# EAGLE design Programmer (EAGLE 9.6.2)
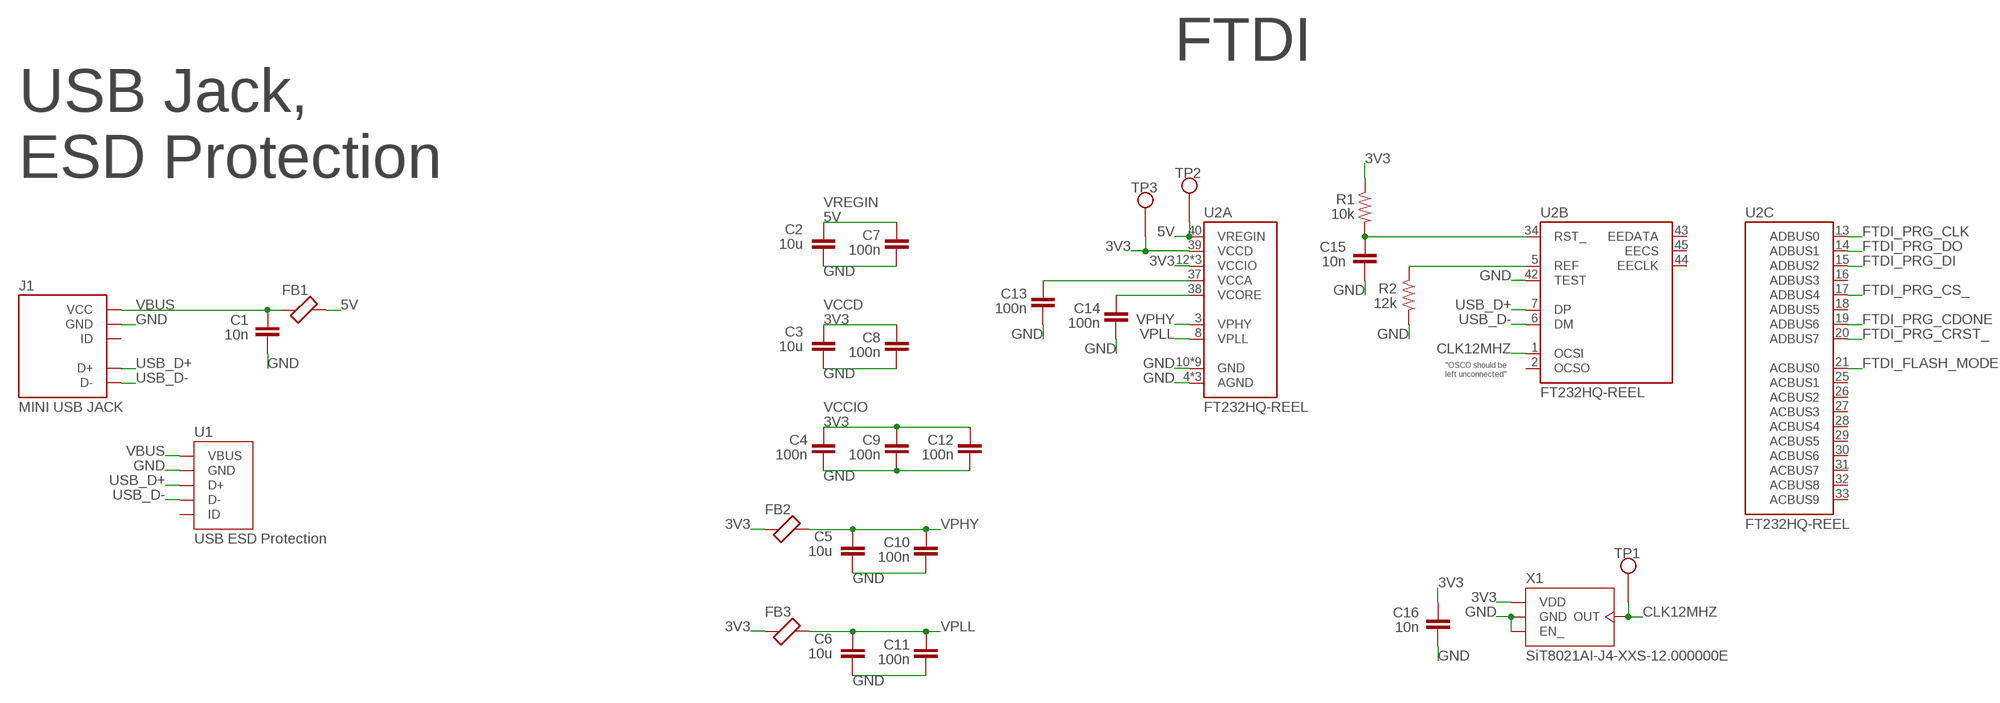
[diagram p0: schematic, sheet 1, part 1 of 2]
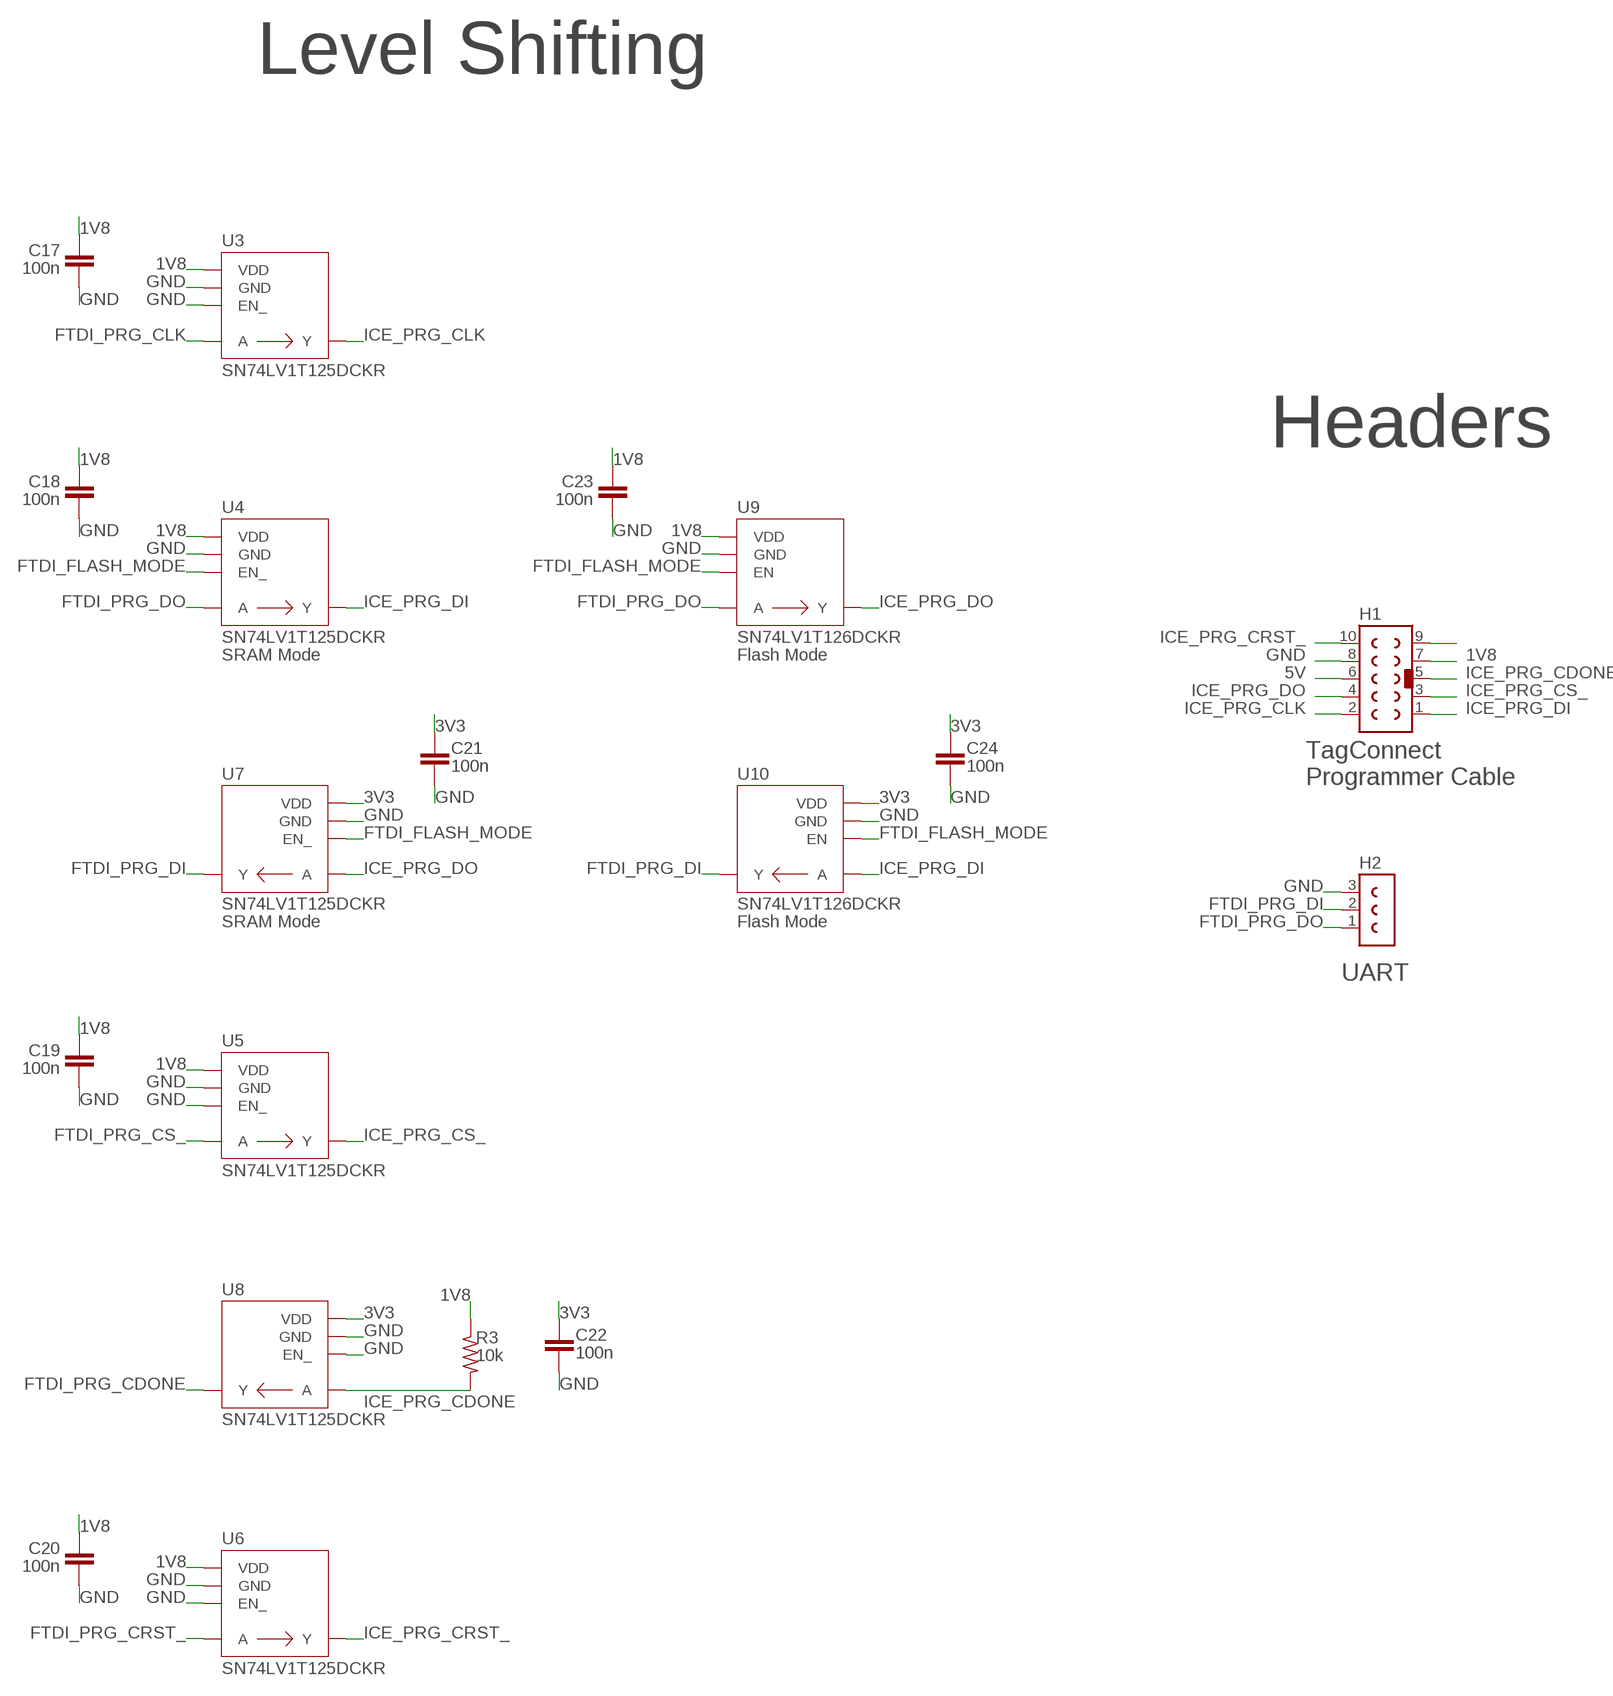
[diagram p1: schematic, sheet 1, part 2 of 2]

## Parts
C1  10n  CAPACITOR0402  [0402]
C2  10u  CAPACITOR1206  [1206]
C3  10u  CAPACITOR1206  [1206]
C4  100n  CAPACITOR0402  [0402]
C5  10u  CAPACITOR1206  [1206]
C6  10u  CAPACITOR1206  [1206]
C7  100n  CAPACITOR0402  [0402]
C8  100n  CAPACITOR0402  [0402]
C9  100n  CAPACITOR0402  [0402]
C10  100n  CAPACITOR0402  [0402]
C11  100n  CAPACITOR0402  [0402]
C12  100n  CAPACITOR0402  [0402]
C13  100n  CAPACITOR0402  [0402]
C14  100n  CAPACITOR0402  [0402]
C15  10n  CAPACITOR0402  [0402]
C16  10n  CAPACITOR0402  [0402]
C17  100n  CAPACITOR0402  [0402]
C18  100n  CAPACITOR0402  [0402]
C19  100n  CAPACITOR0402  [0402]
C20  100n  CAPACITOR0402  [0402]
C21  100n  CAPACITOR0402  [0402]
C22  100n  CAPACITOR0402  [0402]
C23  100n  CAPACITOR0402  [0402]
C24  100n  CAPACITOR0402  [0402]
FB1  FERRITE-BEAD1206  [1206]
FB2  FERRITE-BEAD1206  [1206]
FB3  FERRITE-BEAD1206  [1206]
H1  WURTH-61201021621  [WURTH-61201021621]
H2  HEADER-1X3  [HEADER-1X3]
J1  MINI-USB-JACK  [AMPHENOLFCI-10033526-N3222MLF]
R1  10k  RESISTOR0402  [0402]
R2  12k  RESISTOR0402  [0402]
R3  10k  RESISTOR0402  [0402]
TP1  TEST-POINT  [TEST-POINT]
TP2  TEST-POINT  [TEST-POINT]
TP3  TEST-POINT  [TEST-POINT]
U1  TPD4S012DRYR  [TPD4S012DRYR]
U2  FT232HQ  [FT232HQ]
U3  SN74LV1T125DCKR  [SN74LV1T12XDCKR]
U4  SN74LV1T125DCKR  [SN74LV1T12XDCKR]
U5  SN74LV1T125DCKR  [SN74LV1T12XDCKR]
U6  SN74LV1T125DCKR  [SN74LV1T12XDCKR]
U7  SN74LV1T125DCKR  [SN74LV1T12XDCKR]
U8  SN74LV1T125DCKR  [SN74LV1T12XDCKR]
U9  SN74LV1T126DCKR  [SN74LV1T12XDCKR]
U10  SN74LV1T126DCKR  [SN74LV1T12XDCKR]
X1  SITIME-SIT8021  [SITIME-SIT8021]

## Nets
1V8: C17.1 C18.1 C19.1 C20.1 C23.1 H1.7 R3.1 U3.5(VDD) U4.5(VDD) U5.5(VDD) U6.5(VDD) U9.5(VDD)
3V3: C3.1 C4.1 C8.1 C9.1 C12.1 C16.1 C21.1 C22.1 C24.1 FB2.1 FB3.1 R1.1 TP3.X U2.12(A:VCCIO) U2.24(A:VCCIO) U2.39(A:VCCD) U2.46(A:VCCIO) U7.5(VDD) U8.5(VDD) U10.5(VDD) X1.3(VDD)
5V: C2.1 C7.1 FB1.2 H1.6 TP2.X U2.40(A:VREGIN)
CLK12MHZ: TP1.X U2.1(B:OCSI) X1.2(OUT)
FTDI_FLASH_MODE: U2.21(C:ACBUS0) U4.1(EN_) U7.1(EN_) U9.1(EN) U10.1(EN)
FTDI_PRG_CDONE: U2.19(C:ADBUS6) U8.4(Y)
FTDI_PRG_CLK: U2.13(C:ADBUS0) U3.2(A)
FTDI_PRG_CRST_: U2.20(C:ADBUS7) U6.2(A)
FTDI_PRG_CS_: U2.17(C:ADBUS4) U5.2(A)
FTDI_PRG_DI: H2.2 U2.15(C:ADBUS2) U7.4(Y) U10.4(Y)
FTDI_PRG_DO: H2.1 U2.14(C:ADBUS1) U4.2(A) U9.2(A)
GND: C1.2 C2.2 C3.2 C4.2 C5.2 C6.2 C7.2 C8.2 C9.2 C10.2 C11.2 C12.2 C13.2 C14.2 C15.2 C16.2 C17.2 C18.2 C19.2 C20.2 C21.2 C22.2 C23.2 C24.2 H1.8 H2.3 J1.GND J1.GND2(GND) J1.GND3(GND) J1.GND4(GND) J1.GND5(GND) R2.2 U1.4(GND) U2.4(A:AGND) U2.9(A:AGND) U2.10(A:GND) U2.11(A:GND) U2.22(A:GND) U2.23(A:GND) U2.35(A:GND) U2.36(A:GND) U2.41(A:AGND) U2.42(B:TEST) U2.47(A:GND) U2.48(A:GND) U2.49(A:GND) U3.1(EN_) U3.3(GND) U4.3(GND) U5.1(EN_) U5.3(GND) U6.1(EN_) U6.3(GND) U7.3(GND) U8.1(EN_) U8.3(GND) U9.3(GND) U10.3(GND) X1.1(EN_) X1.4(GND)
ICE_PRG_CDONE: H1.5 R3.2 U8.2(A)
ICE_PRG_CLK: H1.2 U3.4(Y)
ICE_PRG_CRST_: H1.10 U6.4(Y)
ICE_PRG_CS_: H1.3 U5.4(Y)
ICE_PRG_DI: H1.1 U4.4(Y) U10.2(A)
ICE_PRG_DO: H1.4 U7.2(A) U9.4(Y)
N$1: C15.1 R1.2 U2.34(B:RST_)
N$3: C13.1 U2.37(A:VCCA)
N$4: R2.1 U2.5(B:REF)
N$5: C14.1 U2.38(A:VCORE)
N$13: H1.9
USB_D+: J1.D+ U1.1(D+) U2.7(B:DP)
USB_D-: J1.D- U1.2(D-) U2.6(B:DM)
VBUS: C1.1 FB1.1 J1.VCC U1.6(VBUS)
VPHY: C5.1 C10.1 FB2.2 U2.3(A:VPHY)
VPLL: C6.1 C11.1 FB3.2 U2.8(A:VPLL)
Unconnected: J1.ID U1.3(ID) U2.2(B:OCSO) U2.16(C:ADBUS3) U2.18(C:ADBUS5) U2.25(C:ACBUS1) U2.26(C:ACBUS2) U2.27(C:ACBUS3) U2.28(C:ACBUS4) U2.29(C:ACBUS5) U2.30(C:ACBUS6) U2.31(C:ACBUS7) U2.32(C:ACBUS8) U2.33(C:ACBUS9) U2.43(B:EEDATA) U2.44(B:EECLK) U2.45(B:EECS)

## Notes on the sheet
- Level Shifting
- FTDI
- USB Jack,
  ESD Protection
- VREGIN
- Headers
- VCCD
- "OSCO should be
  left unconnected"
- SRAM Mode | Flash Mode
- VCCIO
- TagConnect
  Programmer Cable
- SRAM Mode | Flash Mode
- UART

## Library data of the parts
C1 C15 C16 = EagleLibrary:CAPACITOR; MFG: Murata; PN: GCM155R71H103JA55D
C2 C3 C5 C6 = EagleLibrary:CAPACITOR; MFG: Murata; PN: GCM31CC71E106KA03K
C4 C7-C14 C17-C24 = EagleLibrary:CAPACITOR; MFG: Murata; PN: GRM155R61H104KE19D
FB1-FB3 = EagleLibrary:FERRITE-BEAD; MFG: Murata; PN: BLM31KN801SN1L
H1 = EagleLibrary:WURTH-61201021621; MFG: Wurth Elektronik; PN: 61201021621
H2 = EagleLibrary:HEADER-1X3; MFG: Molex; PN: 22-28-4100
J1 = EagleLibrary:MINI-USB-JACK: Mini USB Jack; MFG: Amphenol FCI; PN: 10033526-N3222MLF
R1 R3 = EagleLibrary:RESISTOR; MFG: Vishay; PN: CRCW040210K0FKEDC
R2 = EagleLibrary:RESISTOR; MFG: Vishay; PN: CRCW040212K0FKEDC
TP1-TP3 = EagleLibrary:TEST-POINT: Bare copper test point
U1 = EagleLibrary:TPD4S012DRYR: 4x USB ESD diode; MFG: Texas Instruments; PN: TPD4S012DRYR
U2 = EagleLibrary:FT232HQ: FTDI chip: USB to UART/FIFO; MFG: FTDI; PN: FT232HQ-REEL
U3-U8 = EagleLibrary:SN74LV1T125DCKR: 1x Level Shifter; MFG: Texas Instruments; PN: SN74LV1T125DCKR
U9 U10 = EagleLibrary:SN74LV1T126DCKR: 1x Level Shifter; MFG: Texas Instruments; PN: SN74LV1T126DCKR
X1 = EagleLibrary:SITIME-SIT8021: MEMS Oscillator; MFG: SiTime; PN: SiT8021AI-J4-XXS-12.000000E

## Board
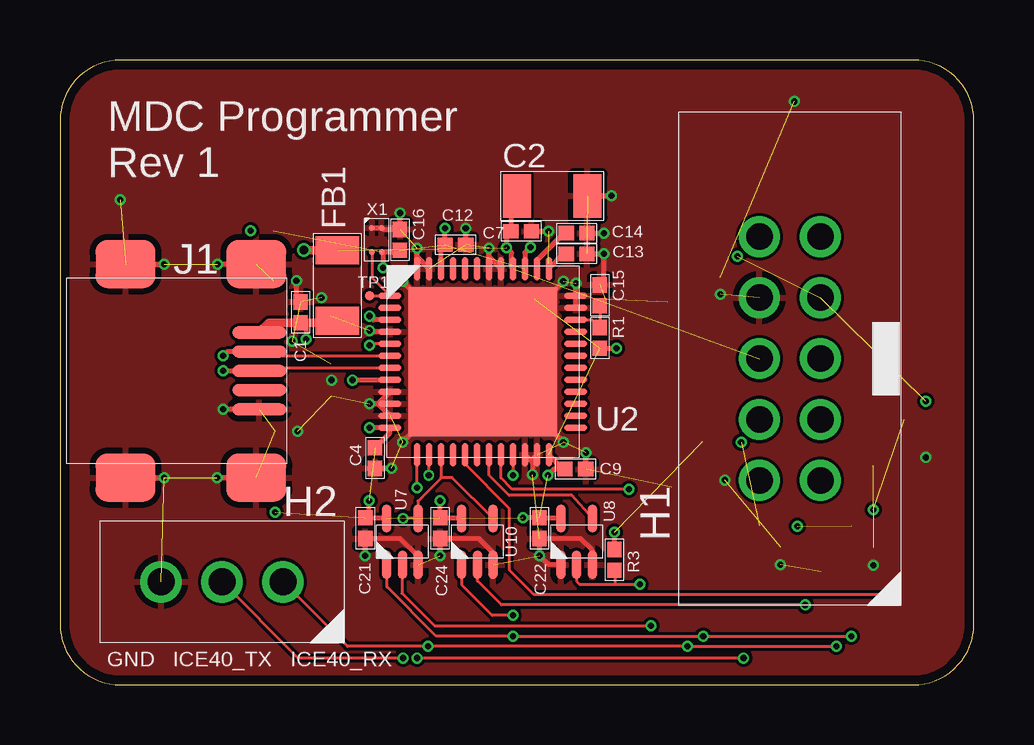
[diagram p2: board, top side]
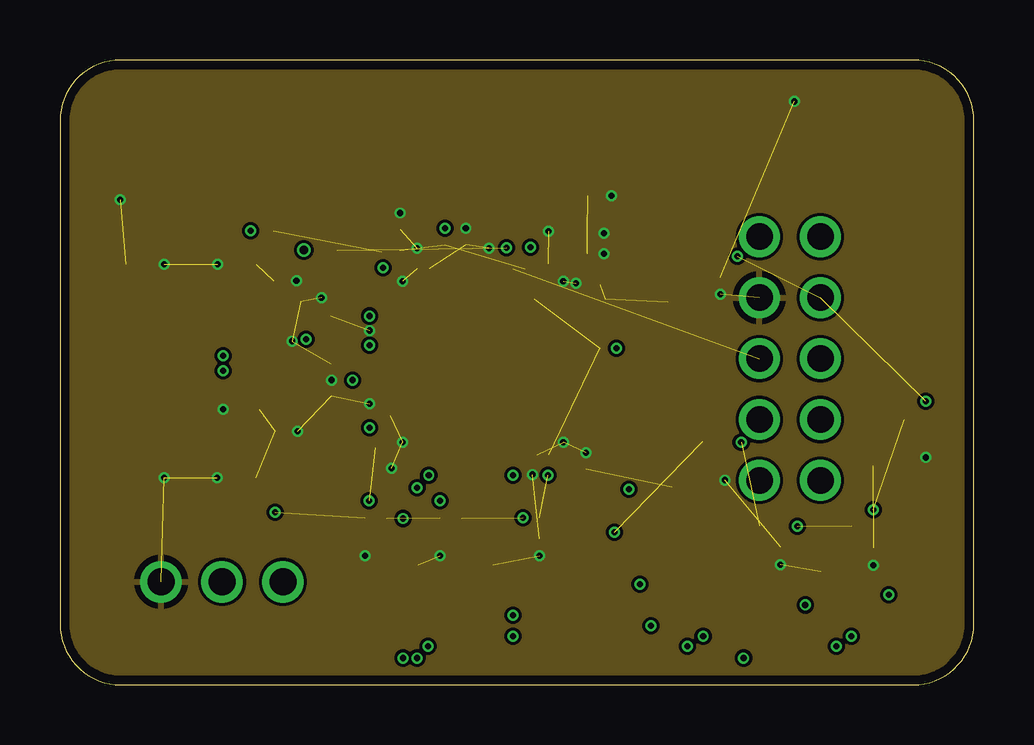
[diagram p3: board, inner layer Ground]
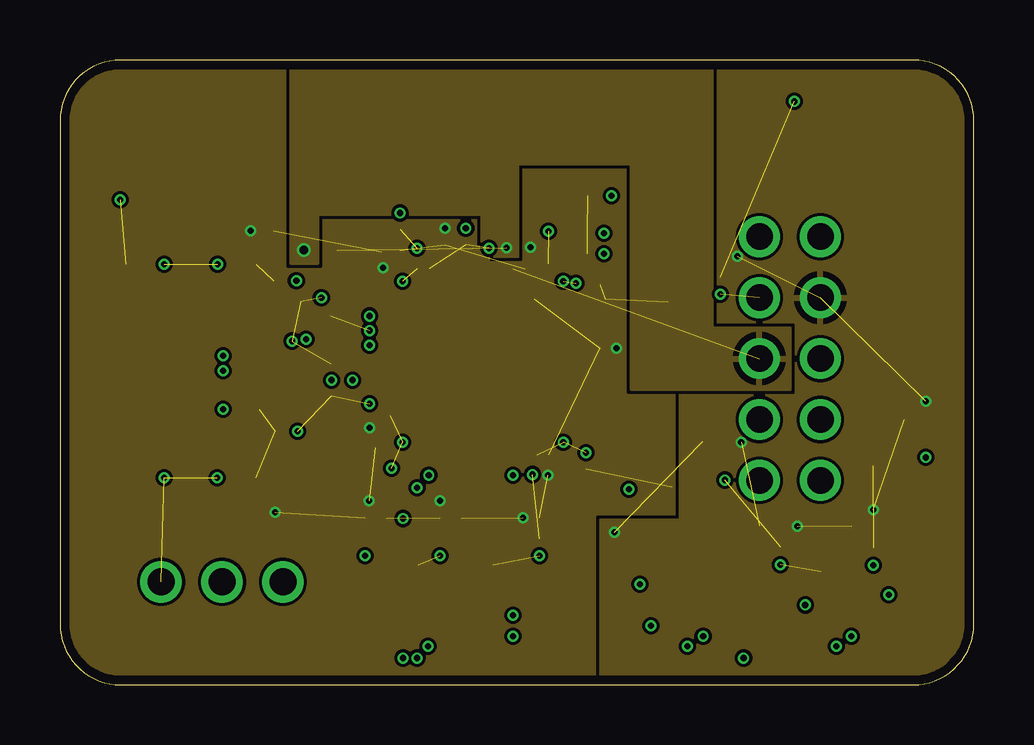
[diagram p4: board, inner layer Power]
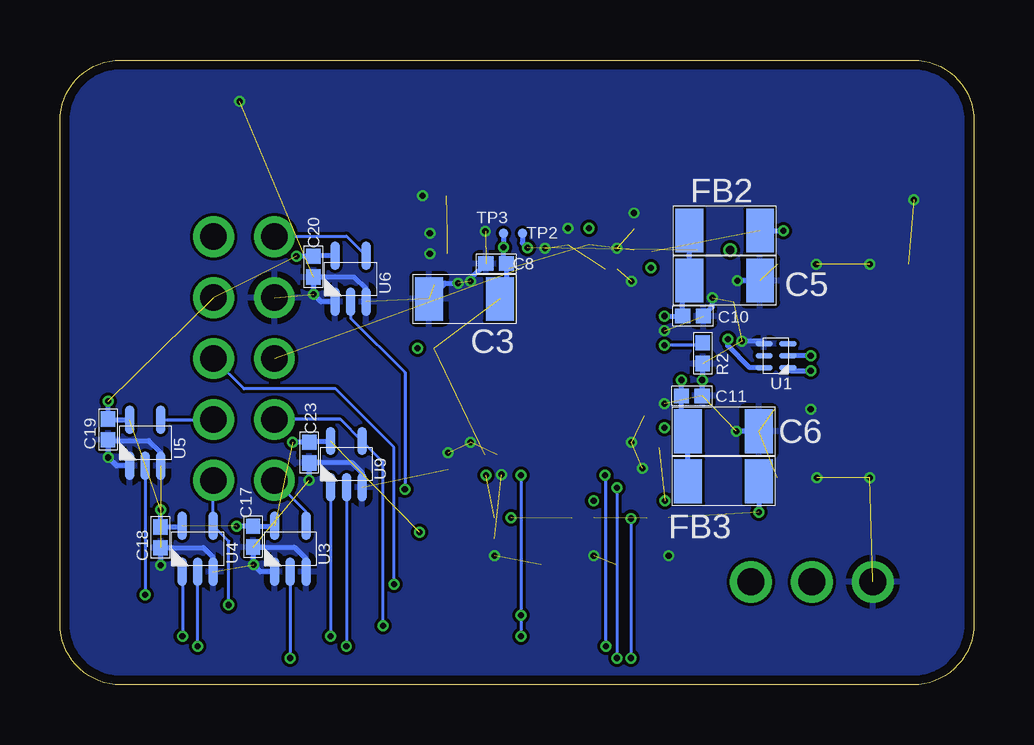
[diagram p5: board, bottom side, seen from below]

Size 38.1 x 26.04 mm. Coordinates in mm from the lower left corner, seen from the top.
Outline: 0,23.5 0,2.54 arc90 2.54,0 35.56,0 arc90 38.1,2.54 38.1,23.5 arc90 35.56,26.04 2.54,26.04 arc90 0,23.5
Copper layers (1*2*15*16): Top 0.035559375mm / dielectric 0.17018125mm / Ground 0.01778125mm / dielectric 47mil / Power 0.01778125mm / dielectric 0.17018125mm / Bottom 0.035559375mm
Design rules "OshPark4Layer-TentVias": minimum track width 5mil, minimum drill 10mil, track to track 5mil, track to pad 5mil, pad to pad 5mil, via to via 5mil, smd to smd 5mil, copper to edge 15mil, drill to drill 6mil, minimum pad ring 4mil, minimum via ring 4mil, stop-mask expansion 2.5mil, vias tented up to drill 25mil, thermal gap 10mil

### Footprints (pad centres in the part's own frame; a part is rotated, then mirrored left to right if it is on the bottom)
0402 = smd 0.635 x 0.6: 1 -0.432,0; 2 0.432,0
1206 = smd 1.165 x 1.815: 1 -1.475,0; 2 1.475,0
WURTH-61201021621 = drill 1.105 pad 1.705: 1 5.895,-15.36; 2 3.355,-15.36; 3 5.895,-12.82; 4 3.355,-12.82; 5 5.895,-10.28; 6 3.355,-10.28; 7 5.895,-7.74; 8 3.355,-7.74; 9 5.895,-5.2; 10 3.355,-5.2
HEADER-1X3 = drill 1.133 pad 1.733: 1 2.54,2.54; 2 2.54,5.08; 3 2.54,7.62
AMPHENOLFCI-10033526-N3222MLF = smd 0.5 x 2.25: D+ 0,2.85; D- -0.8,2.85; GND 1.6,2.85; ID 0.8,2.85; VCC -1.6,2.85 | smd 2 x 2.5: GND2 -4.45,2.725; GND3 -4.45,-2.725; GND4 4.45,-2.725; GND5 4.45,2.725
TEST-POINT = smd 0.4 x 0.4: X 0,0
TPD4S012DRYR = smd 0.71 x 0.22: 1 -0.495,0.5; 2 -0.495,0; 3 -0.495,-0.5; 4 0.495,-0.5; 5 0.495,0; 6 0.495,0.5
FT232HQ = smd 0.961 x 0.27: 1 -3.876,2.75; 2 -3.876,2.25; 3 -3.876,1.75; 4 -3.876,1.25; 5 -3.876,0.75; 6 -3.876,0.25; 7 -3.876,-0.25; 8 -3.876,-0.75; 9 -3.876,-1.25; 10 -3.876,-1.75; 11 -3.876,-2.25; 12 -3.876,-2.75; 25 3.876,-2.75; 26 3.876,-2.25; 27 3.876,-1.75; 28 3.876,-1.25; 29 3.876,-0.75; 30 3.876,-0.25; 31 3.876,0.25; 32 3.876,0.75; 33 3.876,1.25; 34 3.876,1.75; 35 3.876,2.25; 36 3.876,2.75 | smd 0.27 x 0.961: 13 -2.75,-3.876; 14 -2.25,-3.876; 15 -1.75,-3.876; 16 -1.25,-3.876; 17 -0.75,-3.876; 18 -0.25,-3.876; 19 0.25,-3.876; 20 0.75,-3.876; 21 1.25,-3.876; 22 1.75,-3.876; 23 2.25,-3.876; 24 2.75,-3.876; 37 2.75,3.876; 38 2.25,3.876; 39 1.75,3.876; 40 1.25,3.876; 41 0.75,3.876; 42 0.25,3.876; 43 -0.25,3.876; 44 -0.75,3.876; 45 -1.25,3.876; 46 -1.75,3.876; 47 -2.25,3.876; 48 -2.75,3.876 | smd 6.2 x 6.2: 49 0,0
SN74LV1T12XDCKR = smd 1.186 x 0.397: 1 -0.962,0.65; 2 -0.962,0; 3 -0.962,-0.65; 4 0.962,-0.65; 5 0.962,0.65
SITIME-SIT8021 = smd 0.25 x 0.25: 1 -0.205,0.5; 2 -0.205,-0.5; 3 0.205,-0.5; 4 0.205,0.5

### Placement (x,y rotation side)
C1  10.03,15.52 90 top
C2  20.52,20.37 0 top
C3  21.23,16.08 180 bottom
C4  13.13,9.45 270 top
C5  10.39,16.84 0 bottom
C6  10.44,10.57 0 bottom
C7  19.23,18.9 0 top
C8  19.91,17.55 180 bottom
C9  21.49,8.99 0 top
C10  11.71,15.37 0 bottom
C11  11.76,12.04 0 bottom
C12  16.48,18.34 0 top
C13  21.54,17.96 0 top
C14  21.54,18.82 0 top
C15  22.5,16.23 90 top
C16  14.17,18.54 90 top
C17  30.05,6.17 270 bottom
C18  33.91,6.15 270 bottom
C19  36.09,10.64 270 bottom
C20  27.53,17.42 270 bottom
C21  12.73,6.53 270 top
C22  19.99,6.53 270 top
C23  27.71,9.68 270 bottom
C24  15.85,6.53 270 top
FB1  11.56,16.64 90 top
FB2  10.39,18.92 180 bottom
FB3  10.44,8.48 180 bottom
H1  25.81,23.88 0 top
H2  11.84,1.75 90 top
J1  5.46,13.08 270 top
R1  22.5,14.45 90 top
R2  11.3,13.82 270 bottom
R3  23.11,5.21 270 top
TP1  12.9,16.21 0 top
TP2  18.82,18.82 0 bottom
TP3  19.61,18.82 0 bottom
U1  8.26,13.72 180 bottom
U2  17.63,13.46 0 top
U3  28.5,5.67 90 bottom
U4  32.36,5.67 90 bottom
U5  34.54,10.09 90 bottom
U6  25.98,16.92 90 bottom
U7  14.27,5.97 90 top
U8  21.54,5.97 90 top
U9  26.16,9.2 90 bottom
U10  17.4,5.97 90 top
X1  13.21,18.54 0 top

### Tracks (layer width: path | path; a pad name or v marks a point on that pad's centre or on a via)
1V8  (via drill 0.25)  (6 unrouted)
  Top 0.203: R3.1 v23.11,6.35
  Bottom 0.203: v28.25,17.86 C20.1 27.51,17.88 U6.5 | U9.5 27.66,10.16 C23.1 v28.4,10.11 | U3.5 29.18,6.61 C17.1 v30.73,6.61 | U4.5 33.06,6.58 C18.1 v33.91,7.29 | U5.5 36.07,11.05 C19.1 v36.09,11.81
  pour Power (rank 3): 25.85,6.86 22.53,6.86 22.53,-1.4 47.42,-1.4 47.42,30.89 25.85,30.89
3V3  (via drill 0.25)  (10 unrouted)
  Top 0.203: v12.9,10.71 U2.12 13.75,10.5 C4.1 | C16.1 14.11,18.04 X1.3 13.46,17.99 v13.46,17.37 | U2.46 15.88,18.16 C12.1 v16.05,19.02 | U2.24 20.97,8.99 C9.1 20.6,8.99 v20.34,8.74 | R1.1 v23.19,14.02 | U7.5 13.6,6.96 C21.1 12.88,7.11 v12.88,7.67 | U10.5 16.72,6.96 C24.1 v15.85,7.67 | U8.5 20.86,6.96 C22.1 v19.3,6.96 | v19.61,18.24 19.38,18.01 U2.39
  Bottom 0.203: FB2.1 v7.95,18.92 | C8.1 19.61,17.68 | C8.1 19.48,16.36 C3.1 | FB3.1 v8.96,7.19 | TP3.X v19.61,18.24 | v19.61,18.24 | C8.1 19.61,17.68 v19.61,18.24
  pour Power (rank 6): -8.64,46.56 -8.64,-9.6 45.16,-9.6 45.16,46.56
5V  (via drill 0.25, 0.36)  (2 unrouted)
  Top 0.203: U2.40 18.83,17.39 18.83,18 v18.62,18.21 18.62,18.72 C7.1 | C7.1 18.83,18.87 | C2.1 18.8,20.12 C7.1
  Top 0.356: FB1.2 v10.16,18.11
  Bottom 0.203: TP2.X 18.82,18.41 v18.62,18.21
  pour Power: 27.18,14.88 30.43,14.88 30.43,12.29 23.83,12.29 23.83,21.69 19.08,21.69 19.08,17.83 17.6,17.83 17.6,19.58 10.74,19.58 10.74,17.55 9.63,17.55 9.63,30.61 27.18,30.61
CLK12MHZ
  Top 0.127: X1.2 13,16.96 U2.1 TP1.X
FTDI_FLASH_MODE  (via drill 0.25)
  Top 0.127: U2.21 v18.88,8.74 | U10.1 16.76,4.16 18.02,2.9 v18.88,2.9 | U7.1 13.63,5 13.63,4.08 15.68,2.03 v18.88,2.03 v26.81,2.03 v32.99,2.03
  Bottom 0.127: v18.88,8.74 v18.88,2.9 v18.88,2.03 | U4.1 32.99,4.69 v32.99,2.03 | U9.1 v26.81,2.03 | v26.81,2.03
FTDI_PRG_CDONE
  Top 0.127: U8.4 21.35,7.9 18.72,7.9 17.88,8.74 U2.19
FTDI_PRG_CLK  (via drill 0.25)
  Top 0.127: U2.13 14.88,8.21 v14.88,8.2 | v28.5,1.12 v14.88,1.12
  Bottom 0.127: U3.2 v28.5,1.12 | v14.88,8.2 v14.88,1.12
FTDI_PRG_CRST_  (via drill 0.25)
  Top 0.127: v23.72,8.15 18.84,8.15 18.38,8.62 U2.20
  Bottom 0.127: U6.2 25.98,15.27 23.72,13.02 v23.72,8.15
FTDI_PRG_CS_  (via drill 0.25)
  Top 0.127: v34.54,3.76 19.76,3.76 18.73,4.79 18.73,7.35 16.88,9.21 U2.17
  Bottom 0.127: U5.2 v34.54,3.76
FTDI_PRG_DI  (via drill 0.25)
  Top 0.127: 14.93,7.36 U7.4 | 18.05,7.41 U10.4 16.34,8.64 15.88,8.64 | U2.15 15.88,8.64 | 15.88,8.64 15.88,8.61 14.93,7.65 U7.4 | U7.4 v14.3,6.93 | v14.3,1.12 9.93,1.12 H2.2
  Top 0.152: U10.4 18,6.98
  Bottom 0.127: v14.3,6.93 v14.3,1.12
FTDI_PRG_DO  (via drill 0.25)
  Top 0.127: v15.38,8.73 U2.14 | v32.36,1.6 v26.16,1.6 v15.34,1.6 11.99,1.6 H2.1
  Bottom 0.127: U9.2 v26.16,1.6 | v15.38,8.73 15.37,8.72 15.37,1.63 v15.34,1.6 | v32.36,1.6 U4.2
GND  (via drill 0.25)  (36 unrouted)
  Top 0.203: U2.4 12.95,14.71 v12.9,14.76 | U2.49 v14.28,16.82 | U2.49 v20.98,16.82 | U2.49 v20.98,10.11 | U2.49 v14.28,10.11 | U2.48 v14.88,18.19 14.88,17.84 U2.47 | U2.42 v17.88,18.19 17.88,17.84 U2.41 | U2.23 19.7,9.41 v19.7,8.76 19.7,9.26 U2.22 | U2.10 v12.9,11.71 13.25,11.71 | U2.9 13.25,11.71 | U2.11 13.25,11.71 | C1.2 9.86,16.13 v9.86,16.84 | X1.1 X1.4 13.48,18.97 C16.2 v14.17,19.66 | C4.2 v13.82,9.02 | C9.2 v21.92,9.68 | C12.2 v16.92,19.02 | U2.35 U2.36 v21.5,16.74 | C7.2 v20.37,18.9 | C2.2 v22.99,20.37 | C13.2 v22.68,17.96 22.68,16.84 C15.2 | C14.2 v22.68,18.82 | v12.72,5.38 C21.2 14.19,6.09 14.93,5.36 U7.3 | v15.85,5.38 C24.2 17.46,6.09 18.05,5.5 U10.3 | U8.3 22.2,5.6 21.7,6.09 C22.2 v19.99,5.38 20.37,5.01 U8.1 | J1.GND3 v4.34,17.53 | J1.GND2 v6.58,17.53 | J1.GND4 v4.34,8.63 | J1.GND5 v6.55,8.63 | J1.GND v6.81,11.48
  Bottom 0.203: U1.4 8.86,14.33 v9.68,14.33 | C6.2 v9.91,10.57 | C11.2 v11.33,12.7 11.33,13.36 R2.2 | C10.2 10.9,15.75 v10.9,16.13 | C5.2 v9.86,16.84 | C3.2 22.05,16.74 v21.5,16.74 | U6.1 27.21,15.95 v27.53,16.28 C20.2 25.85,16.99 25.33,16.48 U6.3 | v27.71,8.53 C23.2 25.92,9.24 25.51,8.83 U9.3 | U3.3 27.84,5.25 28.33,5.74 C17.2 30.05,5.02 v30.04,5 29.74,4.71 U3.1 | U4.3 31.73,4.73 31.73,5.33 32.11,5.71 C18.2 v33.91,4.98 | U5.3 33.89,9.67 34.39,10.17 36.06,10.17 C19.2 v36.09,9.47 35.74,9.12 U5.1 | C8.2 20.98,16.92 v20.98,16.82
  other vias: 2.51,20.22 30.61,24.31
  pour Ground: -7.67,45.67 -7.67,-8.56 43.97,-8.56 43.97,45.59
  pour Top (rank 2): -6.68,44.81 -6.68,-7.57 43,-7.57 43,44.65
  pour Bottom: -9.63,47.65 -9.63,-10.64 46.15,-10.64 46.15,47.57
ICE_PRG_CDONE  (via drill 0.25)
  Top 0.127: U8.2 21.54,4.32 21.67,4.19 23.14,4.19 | 23.14,4.19 v24.18,4.19 | R3.2 23.14,4.75 23.14,4.19
  Bottom 0.127: H1.5 30.43,12.33 26.61,12.33 24.18,9.9 v24.18,4.19
ICE_PRG_CLK
  Bottom 0.127: U3.4 27.85,7.2 H1.2
ICE_PRG_CRST_
  Bottom 0.127: U6.4 26.16,18.7 29.14,18.7 H1.10
ICE_PRG_CS_
  Bottom 0.127: U5.4 31.71,11.05 H1.3
ICE_PRG_DI  (via drill 0.25)
  Top 0.127: U10.2 17.4,4.33 18.4,3.33 v31.06,3.33
  Bottom 0.127: v31.06,3.33 31.06,5.99 U4.4 31.71,8.51 H1.1
ICE_PRG_DO  (via drill 0.25)
  Top 0.127: U7.2 14.26,4.99 14.26,3.82 15.61,2.46 v24.64,2.46
  Bottom 0.127: H1.4 26.41,11.06 U9.4 24.64,9.29 v24.64,2.46
N$1
  Top 0.127: C15.1 R1.2 22.18,15.21 U2.34
N$3
  Top 0.203: U2.37 21,17.96 C13.1
N$4  (via drill 0.25)
  Top 0.127: U2.5 12.97,14.21 v12.9,14.15
  Bottom 0.127: R2.1 11.4,14.15 v12.9,14.15
N$5
  Top 0.203: U2.38 19.88,17.7 21,18.82 C14.1
USB_D+  (via drill 0.25)
  Top 0.127: J1.D+ 8.44,13.21 U2.7
  Top 0.203: v6.81,13.08 J1.D+
  Bottom 0.203: U1.1 7.62,13.08 v6.81,13.08
USB_D-  (via drill 0.25)
  Top 0.127: J1.D- 8.48,13.71 U2.6
  Top 0.203: J1.D- 7,13.88 v6.81,13.72
  Bottom 0.203: v6.81,13.72 U1.2
VBUS  (via drill 0.25)
  Top 0.203: v10.26,14.4 10.26,14.86 C1.1
  Top 0.356: J1.VCC 8.72,15.09 C1.1 11.48,15.09 FB1.1
  Bottom 0.203: U1.6 9.36,13.22 10.26,14.12 v10.26,14.4
VPHY  (via drill 0.25)
  Top 0.203: U2.3 13.06,15.21 v12.9,15.37
  Bottom 0.203: v12.9,15.37 C10.1 12.14,16.56 C5.1 FB2.2
VPLL  (via drill 0.25)
  Top 0.203: v12.19,12.7 12.2,12.71 U2.8
  Bottom 0.203: v12.19,12.7 C11.1 12.19,10.84 C6.1 FB3.2

### Text on the board
tNames: MDC Programmer / Rev 1 | GND | ICE40_TX | ICE40_RX